# Altium schematic sheet memory.SchDoc
size A4
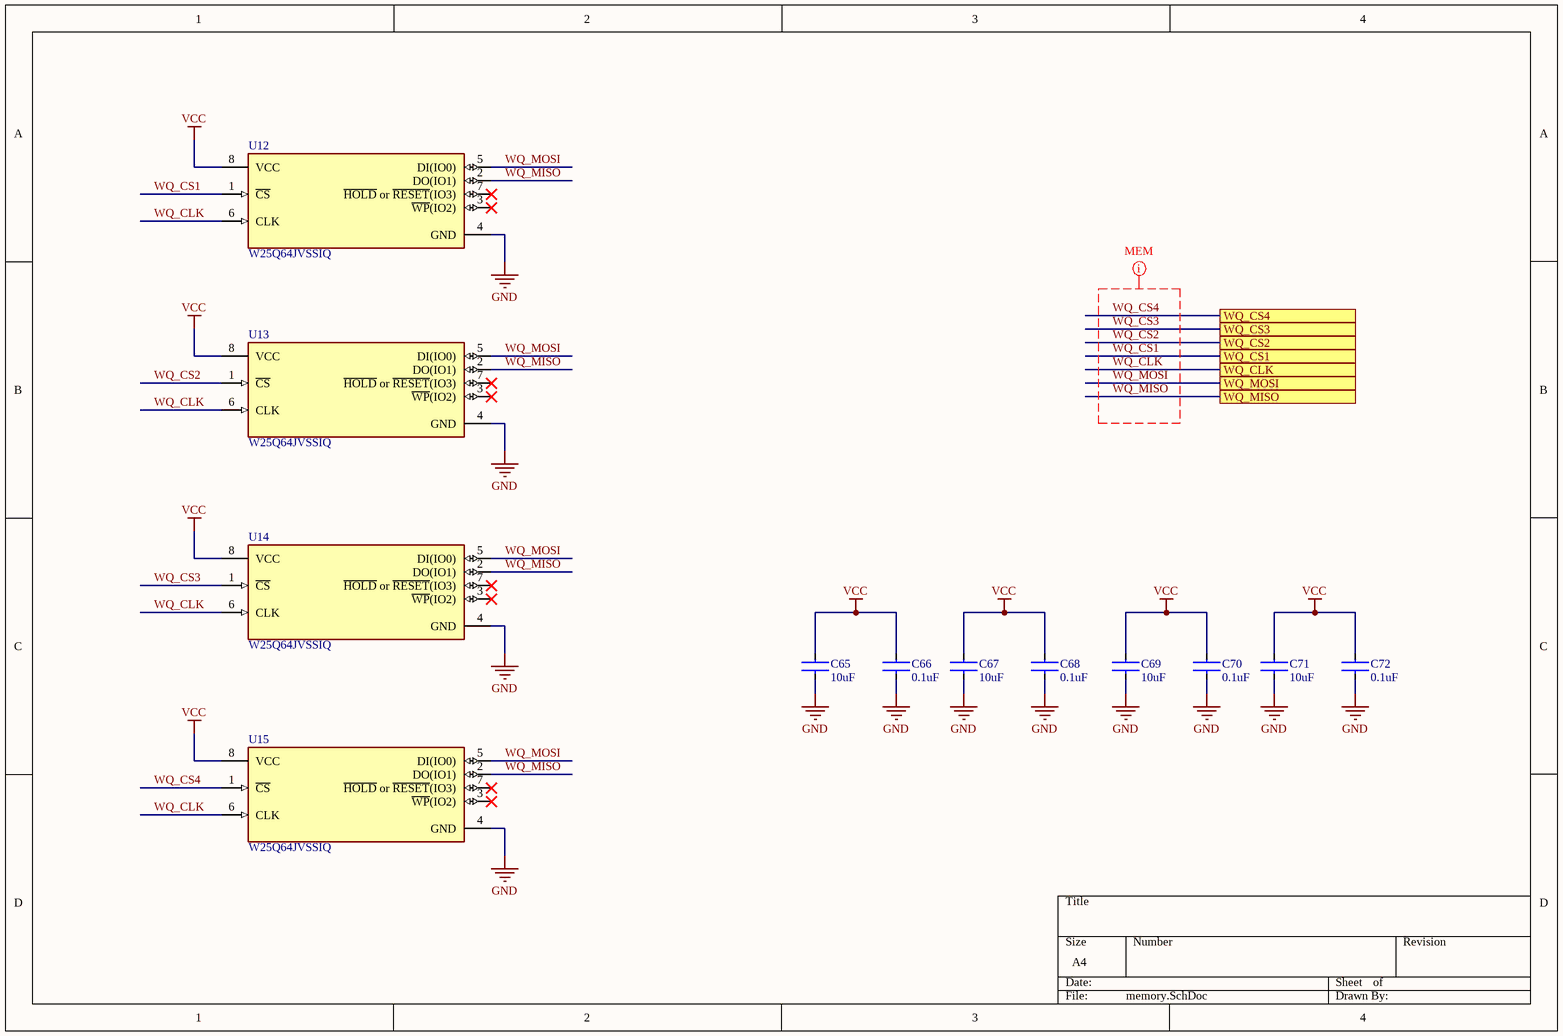
[diagram p0: memory.SchDoc]

## Parts
C65  10uF  [C0402]
C66  0.1uF  [C0402]
C67  10uF  [C0402]
C68  0.1uF  [C0402]
C69  10uF  [C0402]
C70  0.1uF  [C0402]
C71  10uF  [C0402]
C72  0.1uF  [C0402]
U12  W25Q64JVSSIQ  [SOIC-8]
U13  W25Q64JVSSIQ  [SOIC-8]
U14  W25Q64JVSSIQ  [SOIC-8]
U15  W25Q64JVSSIQ  [SOIC-8]

## Ports
WQ_CLK, WQ_CS1, WQ_CS2, WQ_CS3, WQ_CS4, WQ_MISO, WQ_MOSI

## Nets
GND: C65.2 C66.2 C67.2 C68.2 C69.2 C70.2 C71.2 C72.2 U12.4(GND) U13.4(GND) U14.4(GND) U15.4(GND)
VCC: C65.1 C66.1 C67.1 C68.1 C69.1 C70.1 C71.1 C72.1 U12.8(VCC) U13.8(VCC) U14.8(VCC) U15.8(VCC)
WQ_CLK: U12.6(CLK) U13.6(CLK) U14.6(CLK) U15.6(CLK) ; port WQ_CLK
WQ_CS1: U12.1(~{CS}) ; port WQ_CS1
WQ_CS2: U13.1(~{CS}) ; port WQ_CS2
WQ_CS3: U14.1(~{CS}) ; port WQ_CS3
WQ_CS4: U15.1(~{CS}) ; port WQ_CS4
WQ_MISO: U12.2(DO(IO1)) U13.2(DO(IO1)) U14.2(DO(IO1)) U15.2(DO(IO1)) ; port WQ_MISO
WQ_MOSI: U12.5(DI(IO0)) U13.5(DI(IO0)) U14.5(DI(IO0)) U15.5(DI(IO0)) ; port WQ_MOSI

Not connected (* = marked no-connect by the designer): U12 3(~{WP}(IO2))* 7(~{HOLD}_or_~{RESET}(IO3))*; U13 3(~{WP}(IO2))* 7(~{HOLD}_or_~{RESET}(IO3))*; U14 3(~{WP}(IO2))* 7(~{HOLD}_or_~{RESET}(IO3))*; U15 3(~{WP}(IO2))* 7(~{HOLD}_or_~{RESET}(IO3))*

## Layout directives
net class MEM: WQ_CLK, WQ_CS1, WQ_CS2, WQ_CS3, WQ_CS4, WQ_MISO, WQ_MOSI

## Library data of the parts
C65 C67 C69 C71 = CL31B106KOHNNNE: Cap Ceramic 10uF 16V X7R 10% Pad SMD 1206 125°C T/R; Manufacturer: Samsung; Supplier 1: Future Electronics; Manufacturer Part Number: CL31B106KOHNNNE; RoHS: Yes; Category: Ceramic Capacitors; Stock 1: 116000; Pricing 1: 2000=0.03800, 6000=0.03460, 8000=0.03450, 20000=0.03420, 30000=0.03400 (USD); Mount: Surface Mount; Case/Package: 1206; Case Code (Metric): 3216; Case Code (Imperial): 1206; Material: Ceramic; Contact Plating: Tin; Min Operating Temperature: -55°C; Max Operating Temperature: 125°C; Capacitance: 10uF; Tolerance: 10%; Dielectric: X7R; Package Quantity: 1; Packaging: Tape and Reel; Voltage Rating: 16V; Series: CL; Length: 3.2mm; Width: 0.063inch; Height: 1.6mm; Thickness: 0.071inch; Depth: 1.6mm; RoHS Compliant: Yes; ComponentLink1URL: https://datasheet.ciiva.com/25795/cl31b106kohnnne-25795201.pdf?src-supplier=Digi-Key; ComponentLink1Description: https://datasheet.ciiva.com/25795/cl31b106kohnnne-25795201.pdf?src-supplier=Digi-Key; ComponentLink2URL: https://datasheet.ciiva.com/29201/452535-da-01-en-vs-kondensator-1206-29201132.pdf?src-supplier=Conrad; ComponentLink2Description: https://datasheet.ciiva.com/29201/452535-da-01-en-vs-kondensator-1206-29201132.pdf?src-supplier=Conrad; Supplier Part Number 1: 2558872
C66 C68 C70 C72 = CL31B104KBCNNNC: Ceramic capacitor SMD-1206 100nF /50V X7R# K +-10%, Samsung, RoHS; Tolerance: 10%; Dielectric: X7R; Voltage: 50V; Supplier 1: Arrow Electronics; Manufacturer: Samsung; Manufacturer Part Number: CL31B104KBCNNNC; RoHS: Yes; Category: Ceramic Capacitors; Stock 1: 3508000; Pricing 1: 4000=0.02060, 8000=0.01660 (USD); Mount: Surface Mount; Case/Package: 1206; Case Code (Metric): 3216; Case Code (Imperial): 1206; Material: Ceramic; Contact Plating: Tin; Min Operating Temperature: -55°C; Max Operating Temperature: 125°C; Capacitance: 100nF; Voltage Rating (DC): 50V; Packaging: Tape and Reel; Voltage Rating: 50V; Series: CL; Length: 3.2mm; Width: 0.063inch; Height: 0.85mm; Depth: 1.6mm; Thickness: 0.037inch; Radiation Hardening: No; Lead Free: Lead Free; RoHS Compliant: Yes; ComponentLink1URL: https://datasheet.ciiva.com/25710/cl31b104kbcnnnc-25710293.pdf?src-supplier=Digi-Key; ComponentLink1Description: https://datasheet.ciiva.com/25710/cl31b104kbcnnnc-25710293.pdf?src-supplier=Digi-Key; ComponentLink2URL: https://datasheet.ciiva.com/29201/451941-da-01-en-vs-kondensator-1206-29201689.pdf?src-supplier=Conrad; ComponentLink2Description: https://datasheet.ciiva.com/29201/451941-da-01-en-vs-kondensator-1206-29201689.pdf?src-supplier=Conrad; ComponentLink3URL: https://datasheet.ciiva.com/16298/cl05b104kq5nnnc-16298186.pdf?src-supplier=Future+Electronics; ComponentLink3Description: https://datasheet.ciiva.com/16298/cl05b104kq5nnnc-16298186.pdf?src-supplier=Future+Electronics; Supplier Part Number 1: CL31B104KBCNNNC
U12-U15 = W25Q64JVSSIQ: IC FLASH 64MBIT 104MHZ 8SOIC; Manufacturer: Winbond; Memory Type: FLASH,NOR; Interface: SPI,Serial; Max Supply Voltage: 3.6V; Min Supply Voltage: 2.7V; Page Size: 256B; Density: 64MB; Operating Supply Voltage: 3V; Address Bus Width: 24b; Access Time: 6ns; Supplier 1: Arrow Electronics; Manufacturer Part Number: W25Q64JVSSIQ; RoHS: Yes; Category: Flash; Stock 1: 24923; Pricing 1: 1=1.14900, 10=1.03090, 25=1.01110, 50=1.00110, 100=0.92440, 250=0.91670, 500=0.90340, 1000=0.87160, 5000=0.77800 (USD); Mount: Surface Mount; Case/Package: SOIC; Number of Pins: 8; Min Operating Temperature: -40°C; Max Operating Temperature: 85°C; Packaging: Tray; Frequency: 104MHz; RoHS Compliant: Yes; ComponentLink1URL: http://www.winbond.com/resource-files/w25q64jv%20revj%2003272018%20plus.pdf?src-supplier=Digi-Key; ComponentLink1Description: http://www.winbond.com/resource-files/w25q64jv%20revj%2003272018%20plus.pdf?src-supplier=Digi-Key; Supplier Part Number 1: W25Q64JVSSIQ